# EAGLE schematic Escudo_cruz (EAGLE 9.4.2)
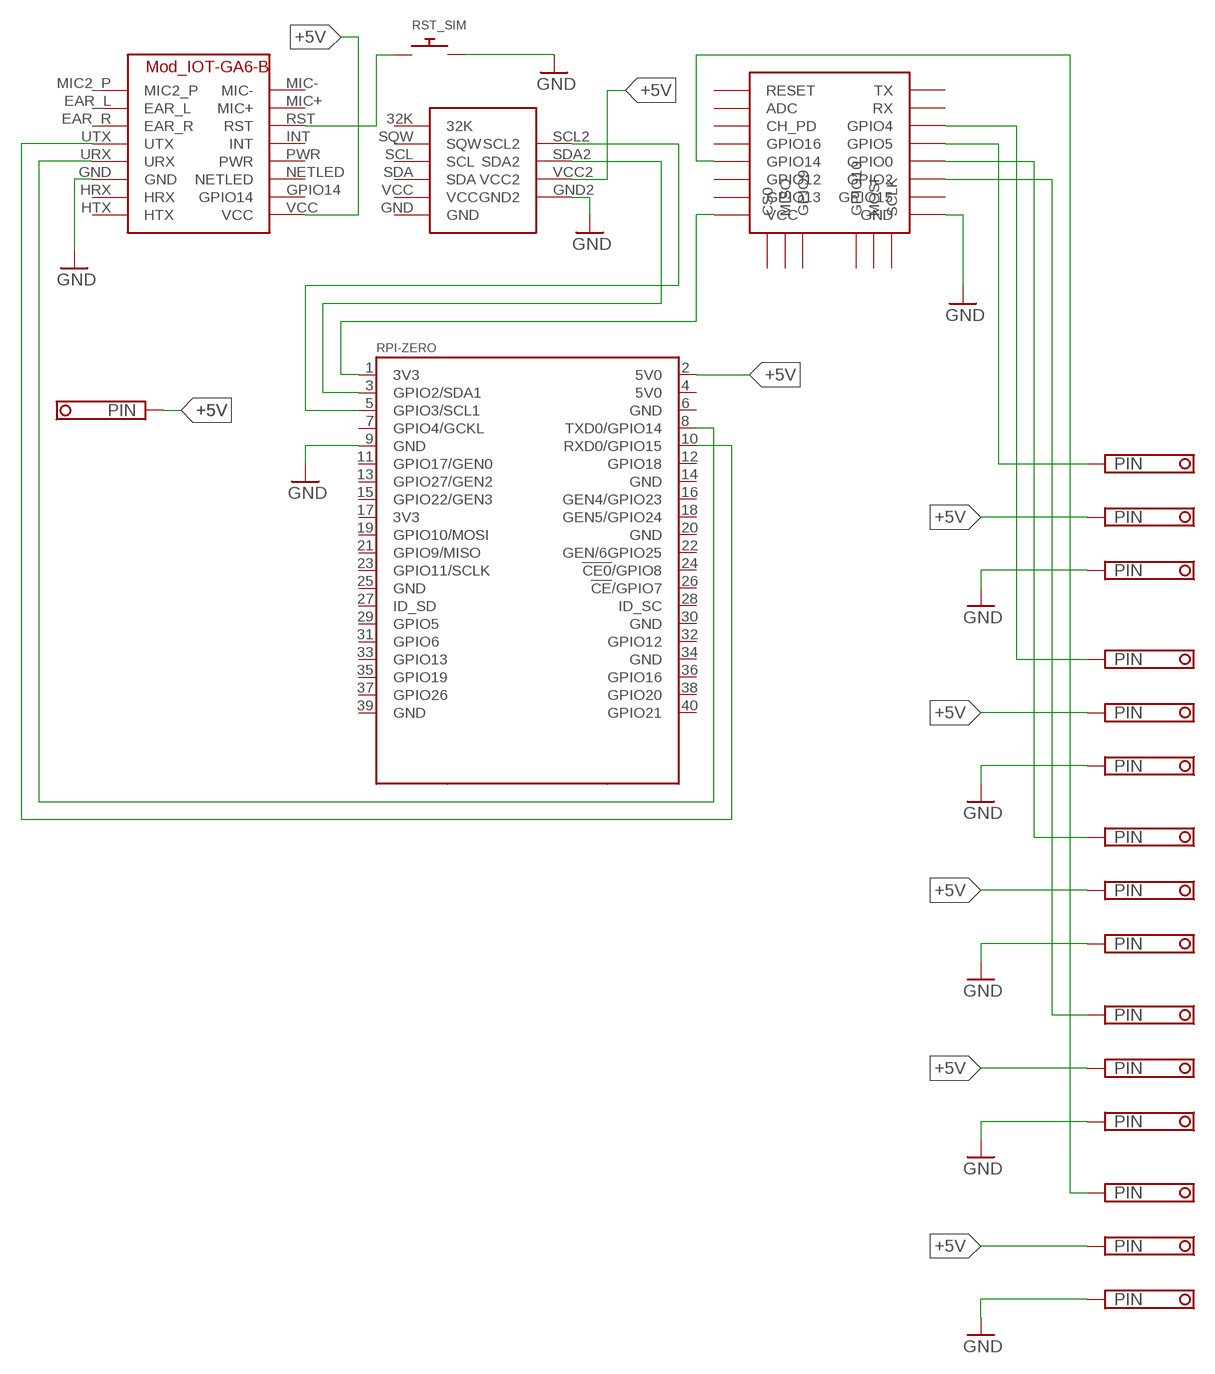
[diagram p0: schematic, sheet 1]

## Parts
AÑO  TERMINAL-BLOCK-3.5MM-3-PIN-ROUND-PAD  [TERMINAL-BLOCK-3-PIN-3.5MM-ROUND-PAD]
CRUZ  TERMINAL-BLOCK-3.5MM-3-PIN-ROUND-PAD  [TERMINAL-BLOCK-3-PIN-3.5MM-ROUND-PAD]
DÍAZ  TERMINAL-BLOCK-3.5MM-3-PIN-ROUND-PAD  [TERMINAL-BLOCK-3-PIN-3.5MM-ROUND-PAD]
ESP8266  ESP12Q  [ESP12Q]
INDICADOR  TERMINAL-BLOCK-3.5MM-3-PIN-ROUND-PAD  [TERMINAL-BLOCK-3-PIN-3.5MM-ROUND-PAD]
MES  TERMINAL-BLOCK-3.5MM-3-PIN-ROUND-PAD  [TERMINAL-BLOCK-3-PIN-3.5MM-ROUND-PAD]
POWER  TERMINAL-BLOCK-3.5MM-2-PIN-ROUND-PAD  [TERMINAL-BLOCK-2-PIN-3.5MM-ROUND-PAD]
RST_SIM  SWITCH_PUSHBUTTONSOFTTOUCHSMD_SJ  [PUSHBUTTON_SMD_SJ]
SIM  IOT-GA6-B  [IOT-GA6-B]
U$2  RPI-ZERO  [RASPBERRYPI_BASTELSTUBE_V13_RASPI_BOARD_B+_FULL]
U$4  RTC_DS3231  [RTC_DS3231]

## Nets
3V3@1: ESP8266.VCC U$2.1(3V3)
+5V: AÑO.2 CRUZ.2 DÍAZ.2 MES.2 POWER.1 SIM.VCC U$2.2(5V0)
GND: AÑO.3 CRUZ.3 DÍAZ.3 ESP8266.GND INDICADOR.3 MES.3 RST_SIM.P$2 SIM.GND U$4.GND2
GND@1: U$2.9(GND) ; supply symbol labelled GND
N$1: SIM.URX U$2.8(TXD0/GPIO14)
N$2: SIM.UTX U$2.10(RXD0/GPIO15)
N$3: U$2.3(GPIO2/SDA1) U$4.SDA2
N$4: U$2.5(GPIO3/SCL1) U$4.SCL2
N$5: RST_SIM.P$1 SIM.RST
N$6: INDICADOR.2
N$7: CRUZ.1 ESP8266.GPIO5
N$9: ESP8266.GPIO14 INDICADOR.1
N$10: U$4.VCC2
N$12: DÍAZ.1 ESP8266.GPIO4
N$13: ESP8266.GPIO0 MES.1
N$14: AÑO.1 ESP8266.GPIO2
Unconnected: ESP8266.ADC ESP8266.CH_PD ESP8266.CS0 ESP8266.GPIO9 ESP8266.GPIO10 ESP8266.GPIO12 ESP8266.GPIO13 ESP8266.GPIO15 ESP8266.GPIO16 ESP8266.MISO ESP8266.MOSI ESP8266.RESET ESP8266.RX ESP8266.SCLK ESP8266.TX POWER.2 SIM.EAR_L SIM.EAR_R SIM.GPIO14 SIM.HRX SIM.HTX SIM.INT SIM.MIC2_P SIM.MIC+ SIM.MIC- SIM.NETLED SIM.PWR U$2.4(5V0) U$2.6(GND) U$2.7(GPIO4/GCKL) U$2.11(GPIO17/GEN0) U$2.12(GPIO18) U$2.13(GPIO27/GEN2) U$2.14(GND) U$2.15(GPIO22/GEN3) U$2.16(GEN4/GPIO23) U$2.17(3V3) U$2.18(GEN5/GPIO24) U$2.19(GPIO10/MOSI) U$2.20(GND) U$2.21(GPIO9/MISO) U$2.22(GEN/6GPIO25) U$2.23(GPIO11/SCLK) U$2.24(!CE0!/GPIO8) U$2.25(GND) U$2.26(!CE!/GPIO7) U$2.27(ID_SD) U$2.28(ID_SC) U$2.29(GPIO5) U$2.30(GND) U$2.31(GPIO6) U$2.32(GPIO12) U$2.33(GPIO13) U$2.34(GND) U$2.35(GPIO19) U$2.36(GPIO16) U$2.37(GPIO26) U$2.38(GPIO20) U$2.39(GND) U$2.40(GPIO21) U$4.32K U$4.GND U$4.SCL U$4.SDA U$4.SQW U$4.VCC

## Library data of the parts
AÑO CRUZ DÍAZ INDICADOR MES = Rembrandt Electronics - Terminal Block 3-5mm v1-0:TERMINAL-BLOCK-3.5MM-3-PIN: Terminal Block 3.5mm Pitch: 3,5 mm Number of pins: 3 Created by Rembrandt Electronics www.rembrandtelectronics.com
ESP8266 = esp826612q:ESP12Q: ESP8266 Wifi module 12-Q
POWER = Rembrandt Electronics - Terminal Block 3-5mm v1-0:TERMINAL-BLOCK-3.5MM-2-PIN: Terminal Block 3.5mm Pitch: 3,5 mm Number of pins: 2 Created by Rembrandt Electronics www.rembrandtelectronics.com
RST_SIM = adafruit:SWITCH_PUSHBUTTON: Buttons SOFTTOUCHSMD_SJ - Soft touch temporary push button (Super Junk Akihabara) Compatible with SKPMANE010 [Mouser: 688-SKPMAN] C&K_KSS = Digikey: KSS221GLFS
SIM = IOT-GA6-B:IOT-GA6-B
U$2 = RASPBERRY_PI-Zero:RPI-ZERO
U$4 = RTC_DS3231:RTC_DS3231